# Altium schematic sheet SCHEMATICS.schdoc
size 375 x 303 mm
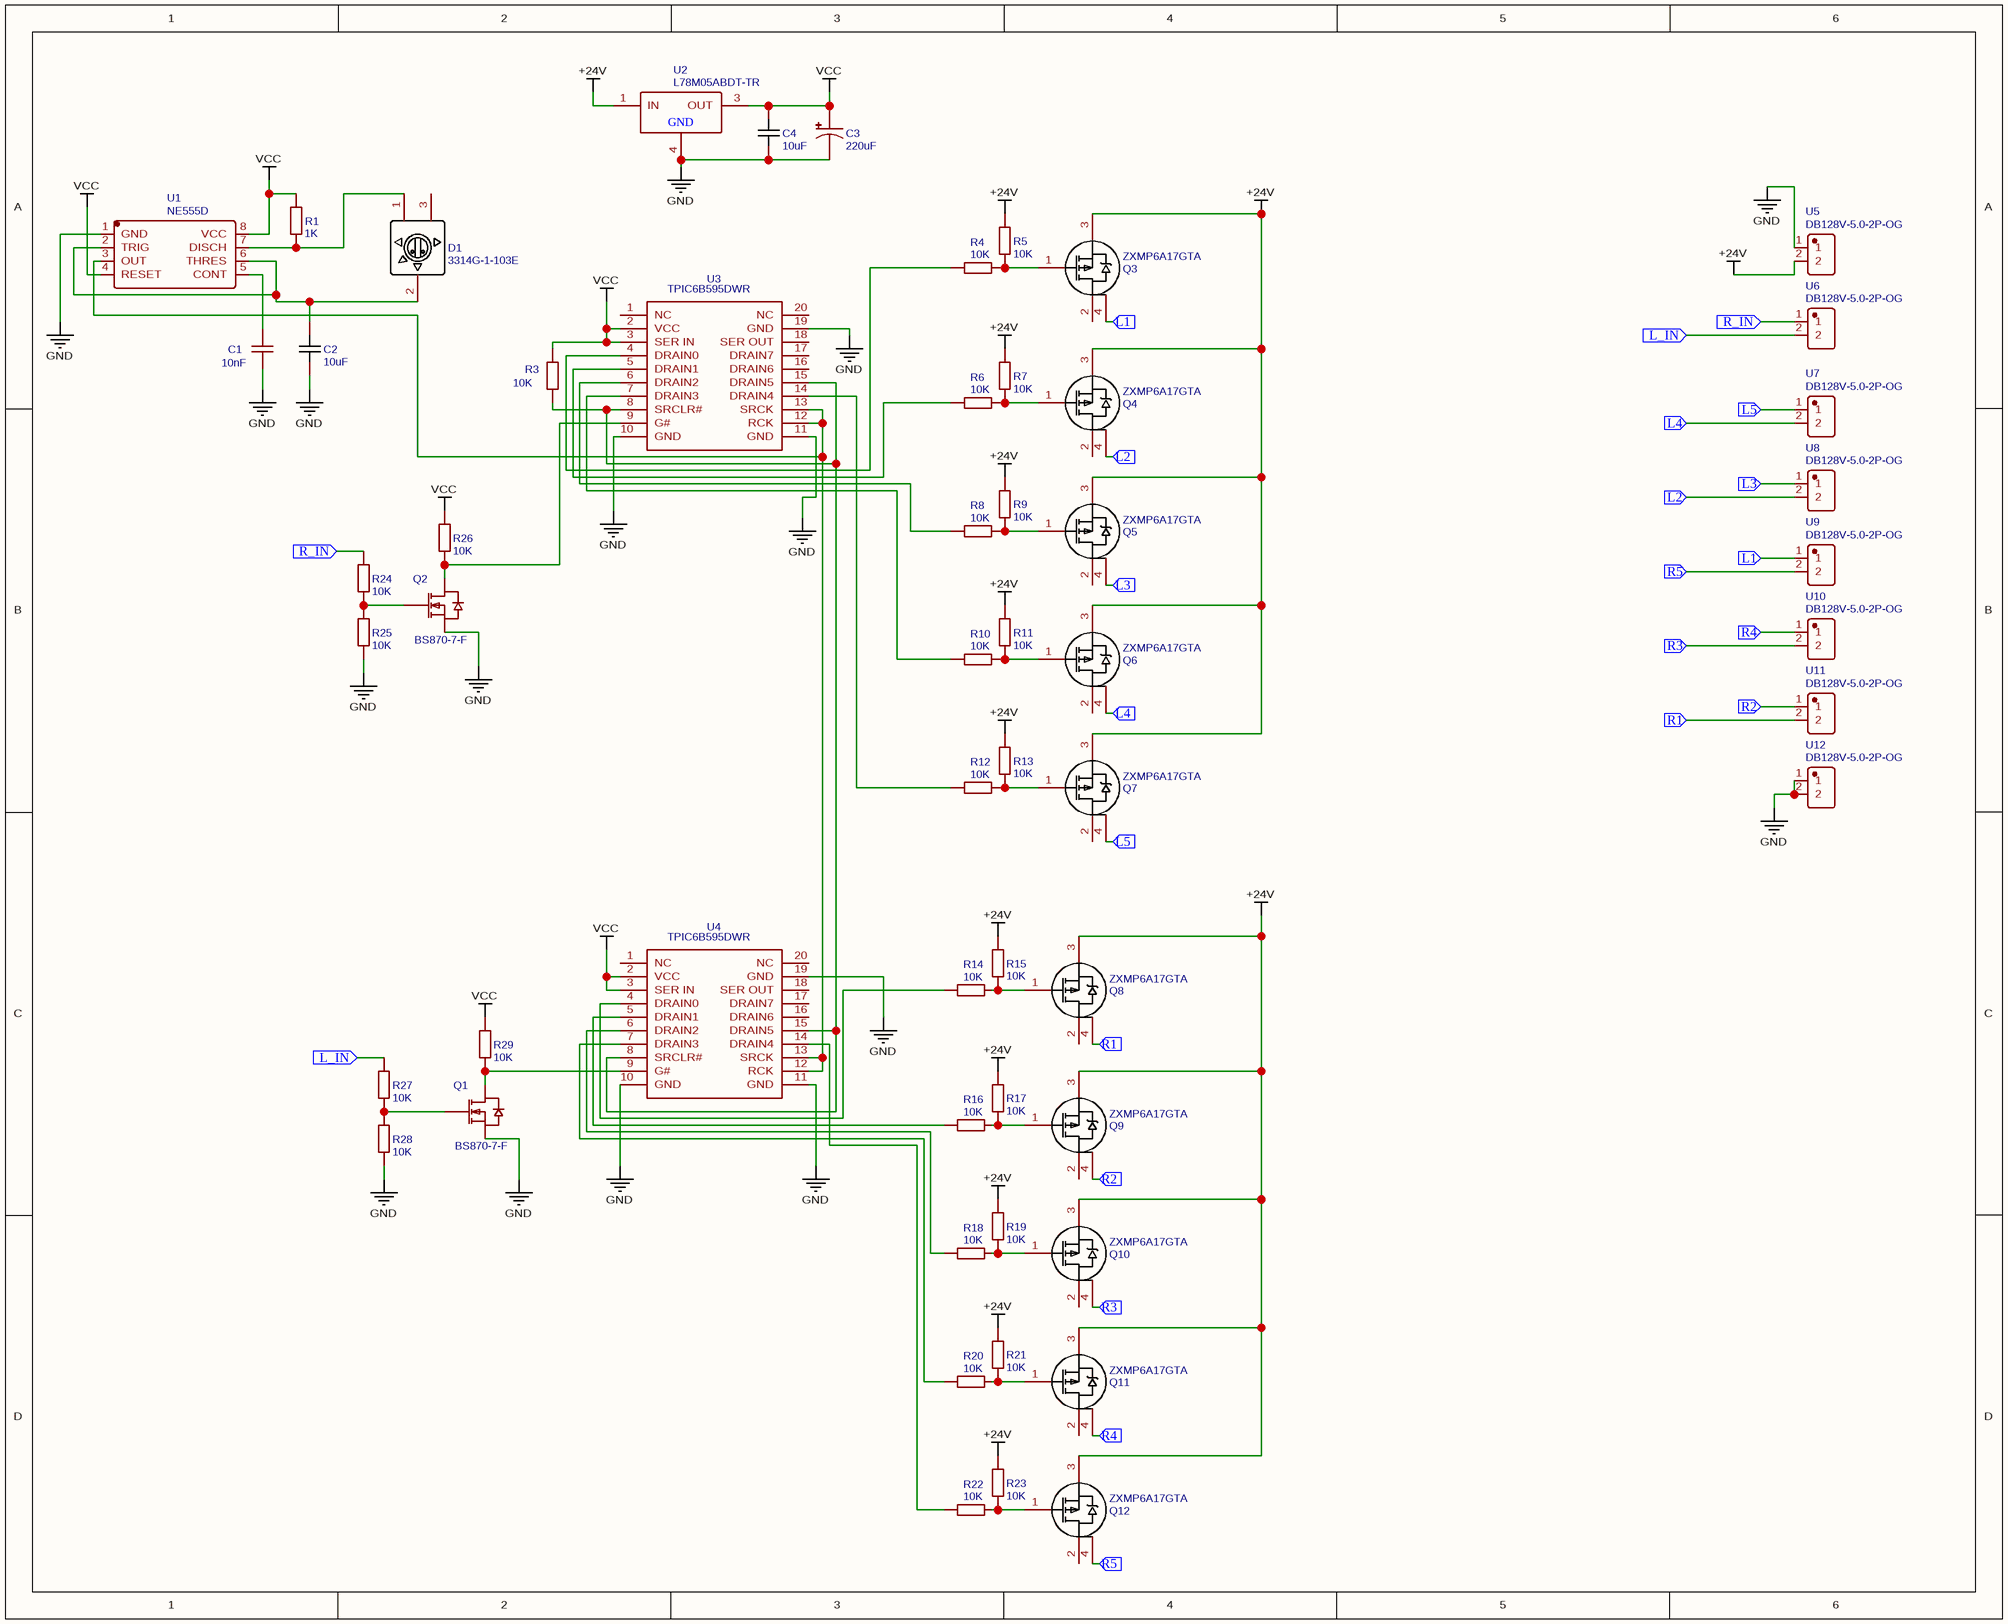
[diagram p0: SCHEMATICS.schdoc]

## Parts
C1  10nF  [C0603]
C2  10uF  [C0603]
C3  220uF  [CAP-SMD_BD10.0-L10.3-W10.3-RD]
C4  10uF  [C0603]
D1  3314G-1-103E  [RES-ADJ-SMD_3314G-1-103E]
Q1  BS870-7-F  [SOT-23-3_L3.0-W1.7-P0.95-LS2.9-BR]
Q2  BS870-7-F  [SOT-23-3_L3.0-W1.7-P0.95-LS2.9-BR]
Q3  ZXMP6A17GTA  [SOT-223-4_L6.5-W3.5-P2.30-LS7.0-BR]
Q4  ZXMP6A17GTA  [SOT-223-4_L6.5-W3.5-P2.30-LS7.0-BR]
Q5  ZXMP6A17GTA  [SOT-223-4_L6.5-W3.5-P2.30-LS7.0-BR]
Q6  ZXMP6A17GTA  [SOT-223-4_L6.5-W3.5-P2.30-LS7.0-BR]
Q7  ZXMP6A17GTA  [SOT-223-4_L6.5-W3.5-P2.30-LS7.0-BR]
Q8  ZXMP6A17GTA  [SOT-223-4_L6.5-W3.5-P2.30-LS7.0-BR]
Q9  ZXMP6A17GTA  [SOT-223-4_L6.5-W3.5-P2.30-LS7.0-BR]
Q10  ZXMP6A17GTA  [SOT-223-4_L6.5-W3.5-P2.30-LS7.0-BR]
Q11  ZXMP6A17GTA  [SOT-223-4_L6.5-W3.5-P2.30-LS7.0-BR]
Q12  ZXMP6A17GTA  [SOT-223-4_L6.5-W3.5-P2.30-LS7.0-BR]
R1  1K  [R0603]
R3  10K  [R0603]
R4  10K  [R0603]
R5  10K  [R0603]
R6  10K  [R0603]
R7  10K  [R0603]
R8  10K  [R0603]
R9  10K  [R0603]
R10  10K  [R0603]
R11  10K  [R0603]
R12  10K  [R0603]
R13  10K  [R0603]
R14  10K  [R0603]
R15  10K  [R0603]
R16  10K  [R0603]
R17  10K  [R0603]
R18  10K  [R0603]
R19  10K  [R0603]
R20  10K  [R0603]
R21  10K  [R0603]
R22  10K  [R0603]
R23  10K  [R0603]
R24  10K  [R0603]
R25  10K  [R0603]
R26  10K  [R0603]
R27  10K  [R0603]
R28  10K  [R0603]
R29  10K  [R0603]
U1  NE555D  [SOIC-8_L5.0-W4.0-P1.27-LS6.0-BL]
U2  L78M05ABDT-TR  [TO-252-2_L6.5-W6.1-P4.58-LS10.0-TL]
U3  TPIC6B595DWR  [SOIC-20_L13.0-W7.6-P1.27-LS10.6-BL]
U4  TPIC6B595DWR  [SOIC-20_L13.0-W7.6-P1.27-LS10.6-BL]
U5  DB128V-5.0-2P-OG  [CONN-TH_DB128V-5.0-2P-XX]
U6  DB128V-5.0-2P-OG  [CONN-TH_DB128V-5.0-2P-XX]
U7  DB128V-5.0-2P-OG  [CONN-TH_DB128V-5.0-2P-XX]
U8  DB128V-5.0-2P-OG  [CONN-TH_DB128V-5.0-2P-XX]
U9  DB128V-5.0-2P-OG  [CONN-TH_DB128V-5.0-2P-XX]
U10  DB128V-5.0-2P-OG  [CONN-TH_DB128V-5.0-2P-XX]
U11  DB128V-5.0-2P-OG  [CONN-TH_DB128V-5.0-2P-XX]
U12  DB128V-5.0-2P-OG  [CONN-TH_DB128V-5.0-2P-XX]

## Ports
L1 (in), L2 (in), L3 (in), L4 (in), L5 (in), L_IN (in), R1 (in), R2 (in), R3 (in), R4 (in), R5 (in), R_IN (in)

## Nets
+24V: Q3.3(S) Q4.3(S) Q5.3(S) Q6.3(S) Q7.3(S) Q8.3(S) Q9.3(S) Q10.3(S) Q11.3(S) Q12.3(S) R5.1 R7.1 R9.1 R11.1 R13.1 R15.1 R17.1 R19.1 R21.1 R23.1 U2.1(IN) U5.2
GND: C1.2 C2.2 C3.2 C4.2 Q1.2(S) Q2.2(S) R25.1 R28.1 U1.1(GND) U2.4(GND) U3.10(GND) U3.11(GND) U3.19(GND) U4.10(GND) U4.11(GND) U4.19(GND) U5.1 U12.1 U12.2
VCC: C3.1 C4.1 R1.2 R3.1 R26.2 R29.2 U1.4(RESET) U1.8(VCC) U2.3(OUT) U3.2(VCC) U3.3(SER_IN) U4.2(VCC) U4.3(SER_IN)
L1: Q3.4(D) U9.1 ; port L1
L2: Q4.4(D) U8.2 ; port L2
L3: Q5.4(D) U8.1 ; port L3
L4: Q6.4(D) U7.2 ; port L4
L5: Q7.4(D) U7.1 ; port L5
L_IN: R27.2 U6.2 ; port L_IN
R1: Q8.4(D) U11.2 ; port R1
R2: Q9.4(D) U11.1 ; port R2
R3: Q10.4(D) U10.2 ; port R3
R4: Q11.4(D) U10.1 ; port R4
R5: Q12.4(D) U9.2 ; port R5
R_IN: R24.2 U6.1 ; port R_IN
NetC1_1: C1.1 U1.5(CONT)
NetC2_1: C2.1 D1.2 U1.2(TRIG) U1.6(THRES)
NetD1_1: D1.1 R1.1 U1.7(DISCH)
NetQ1_1: Q1.1(G) R27.1 R28.2
NetQ1_3: Q1.3(D) R29.1 U4.9(G#)
NetQ2_1: Q2.1(G) R24.1 R25.2
NetQ2_3: Q2.3(D) R26.1 U3.9(G#)
NetQ3_1: Q3.1(G) R4.2 R5.2
NetQ4_1: Q4.1(G) R6.2 R7.2
NetQ5_1: Q5.1(G) R8.2 R9.2
NetQ6_1: Q6.1(G) R10.2 R11.2
NetQ7_1: Q7.1(G) R12.2 R13.2
NetQ8_1: Q8.1(G) R14.2 R15.2
NetQ9_1: Q9.1(G) R16.2 R17.2
NetQ10_1: Q10.1(G) R18.2 R19.2
NetQ11_1: Q11.1(G) R20.2 R21.2
NetQ12_1: Q12.1(G) R22.2 R23.2
NetR3_2: R3.2 U3.8(SRCLR#) U3.15(DRAIN5) U4.8(SRCLR#) U4.15(DRAIN5)
NetR4_1: R4.1 U3.4(DRAIN0)
NetR6_1: R6.1 U3.5(DRAIN1)
NetR8_1: R8.1 U3.6(DRAIN2)
NetR10_1: R10.1 U3.7(DRAIN3)
NetR12_1: R12.1 U3.14(DRAIN4)
NetR14_1: R14.1 U4.4(DRAIN0)
NetR16_1: R16.1 U4.5(DRAIN1)
NetR18_1: R18.1 U4.6(DRAIN2)
NetR20_1: R20.1 U4.7(DRAIN3)
NetR22_1: R22.1 U4.14(DRAIN4)
NetU1_3: U1.3(OUT) U3.12(RCK) U3.13(SRCK) U4.12(RCK) U4.13(SRCK)

Not connected (* = marked no-connect by the designer): D1 3; Q3 2(D); Q4 2(D); Q5 2(D); Q6 2(D); Q7 2(D); Q8 2(D); Q9 2(D); Q10 2(D); Q11 2(D); Q12 2(D); U3 1(NC) 16(DRAIN6) 17(DRAIN7) 18(SER_OUT) 20(NC); U4 1(NC) 16(DRAIN6) 17(DRAIN7) 18(SER_OUT) 20(NC)

## Library data of the parts
C1 = 10nF: BOM_Manufacturer: SAMSUNG; BOM_Manufacturer Part: CL10B103KC8NNNC; nameAlias: Capacitance; Contributor: LCSC; SMT Type: Extend; BOM_Supplier: LCSC; BOM_Supplier Part: C84709; BOM_LCSC Assembly: Yes; spicePre: C; spiceSymbolName: CL10B103KC8NNNC
C2 C4 = 10uF: BOM_Manufacturer: SAMSUNG; BOM_Manufacturer Part: CL10A106KP8NNNC; nameAlias: Capacitance; SMT Type: Basic; BOM_Supplier: LCSC; BOM_LCSC Assembly: Yes; BOM_Supplier Part: C19702; spicePre: C; spiceSymbolName: CL10A106KP8NNNC
C3 = 220uF: BOM_Manufacturer: Lelon; BOM_Manufacturer Part: OVU221M1C1010-TRO; nameAlias: Capacitance; Contributor: LCSC; SMT Type: Extend; BOM_Supplier: LCSC; BOM_Supplier Part: C250080; BOM_LCSC Assembly: Yes; spicePre: C; spiceSymbolName: OVU221M1C1010-TRO
D1 = 3314G-1-103E: BOM_Manufacturer: BOURNS; Contributor: LCSC; BOM_Supplier: LCSC; BOM_Supplier Part: C780220; BOM_Manufacturer Part: 3314G-1-103E; BOM_JLCPCB Part Class: Extended Part; spicePre: D; spiceSymbolName: 3314G-1-103E
Q1 Q2 = BS870-7-F: BOM_Manufacturer: Diodes Incorporated; Contributor: LCSC; SMT Type: Extend; BOM_Supplier: LCSC; BOM_Supplier Part: C216212; BOM_Manufacturer Part: BS870-7-F; BOM_LCSC Assembly: Yes; spicePre: Q; spiceSymbolName: BS870-7-F
Q3-Q12 = ZXMP6A17GTA: BOM_Manufacturer: DIODES; Contributor: LCSC; SMT Type: Extend; BOM_Supplier: LCSC; BOM_Manufacturer Part: ZXMP6A17GTA; BOM_Supplier Part: C154719; BOM_JLCPCB SMD: Yes; BOM_LCSC Assembly: Yes; spicePre: Q; spiceSymbolName: ZXMP6A17GTA
R1 = 1K: BOM_Manufacturer: UniOhm; BOM_Manufacturer Part: 0603WAF1001T5E; nameAlias: Resistance (Ohms); SMT Type: Basic; BOM_Supplier: LCSC; BOM_LCSC Assembly: Yes; BOM_Supplier Part: C21190; spicePre: R; spiceSymbolName: 0603WAF1001T5E
R3-R29 = 10K: BOM_Manufacturer: UniOhm; BOM_Manufacturer Part: 0603WAF1002T5E; nameAlias: Resistance (Ohms); SMT Type: Basic; BOM_Supplier: LCSC; BOM_LCSC Assembly: Yes; BOM_Supplier Part: C25804; spicePre: R; spiceSymbolName: 0603WAF1001T5E
U1 = NE555D: BOM_Manufacturer: Texas Instruments; Contributor: LCSC; SMT Type: Extend; BOM_Supplier: LCSC; BOM_Supplier Part: C234230; BOM_Manufacturer Part: NE555D; BOM_LCSC Assembly: Yes; spicePre: U; spiceSymbolName: NE555D
U2 = L78M05ABDT-TR: BOM_Manufacturer: STMicroelectronics; SMT Type: Basic; BOM_Supplier: LCSC; BOM_Manufacturer Part: L78M05ABDT-TR; BOM_LCSC Assembly: Yes; image: //image.lceda.cn/szlcsc/C58069.jpg; BOM_Supplier Part: C58069; spicePre: U; spiceSymbolName: L78M05ABDT-TR
U3 U4 = TPIC6B595DWR: BOM_Manufacturer: TI; SMT Type: Extend; BOM_Supplier: LCSC; BOM_Manufacturer Part: TPIC6B595DWR; image: //image.lceda.cn/szlcsc/C7094.jpg; BOM_Supplier Part: C7094; BOM_LCSC Assembly: Yes; spicePre: U; spiceSymbolName: TPIC6B595DWR
U5-U12 = DB128V-5.0-2P-OG: BOM_Manufacturer: DIBO; Contributor: LCSC; BOM_Supplier: LCSC; BOM_Supplier Part: C424694; BOM_Manufacturer Part: DB128V-5.0-2P-OG; spicePre: U; spiceSymbolName: DB128V-5.0-2P-OG